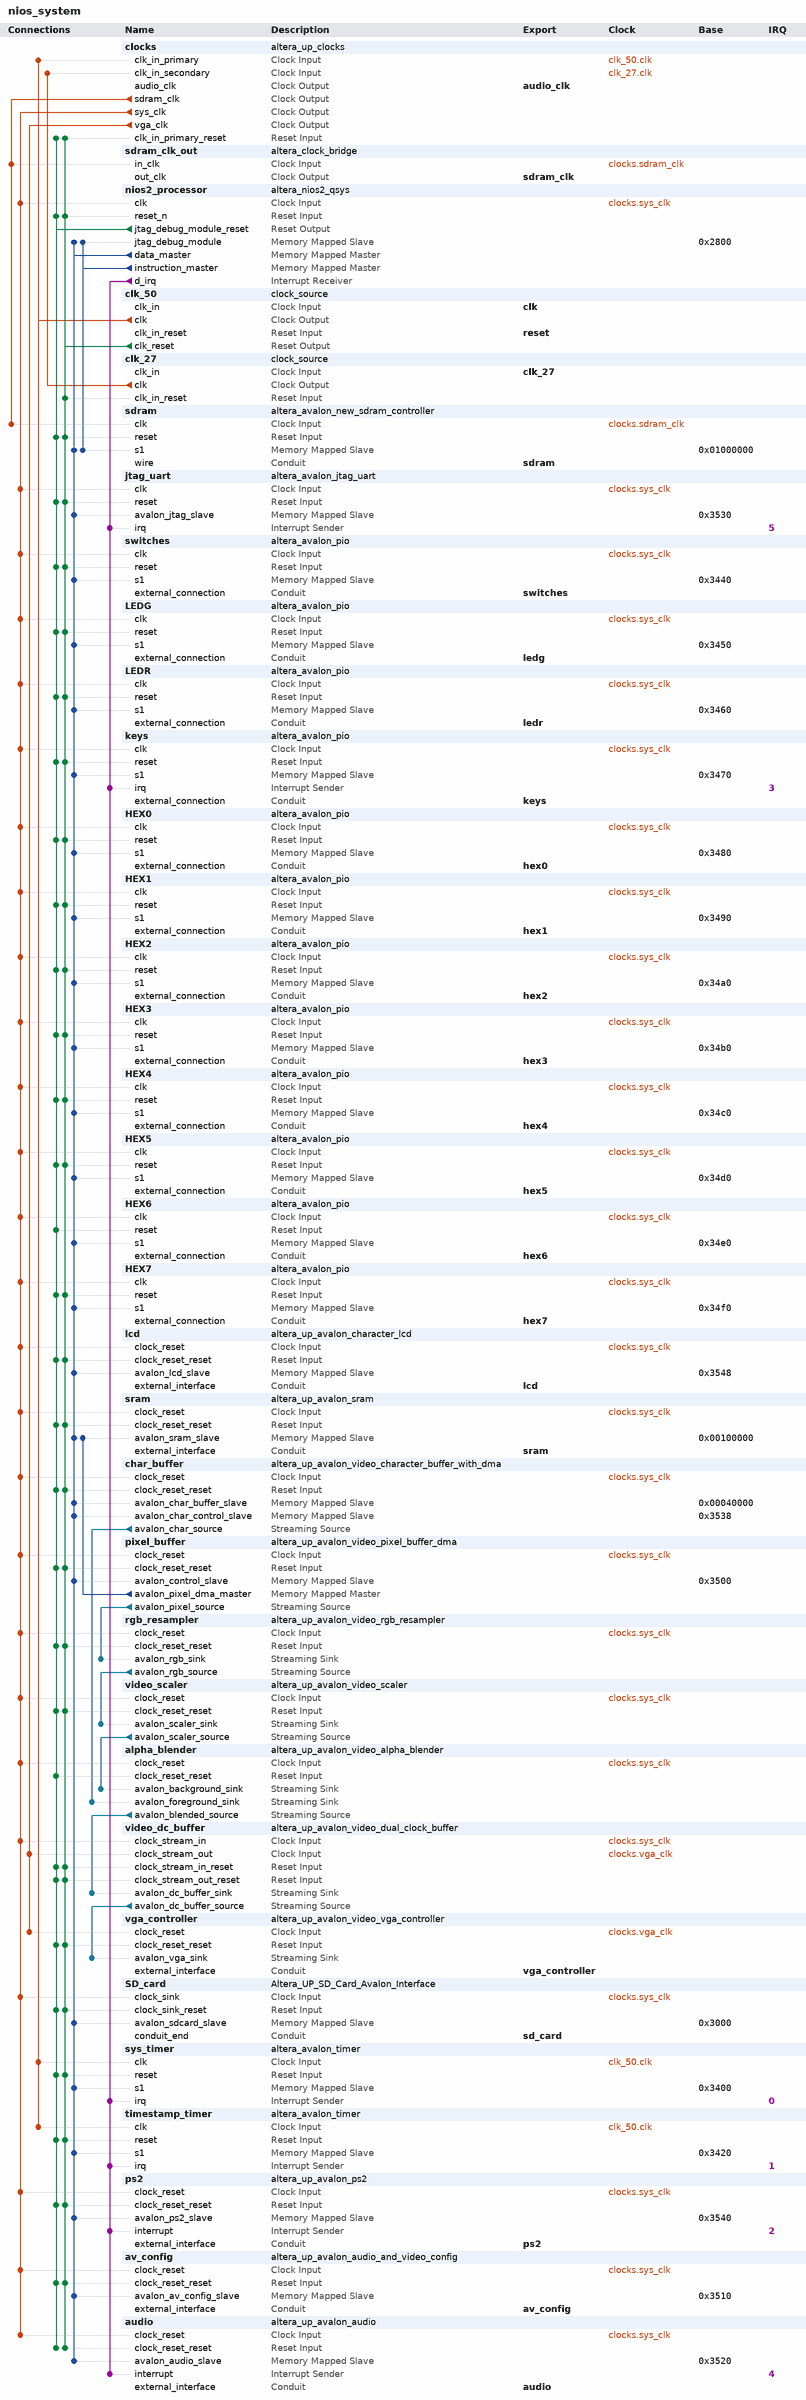
[diagram p0: system contents]
# Platform Designer (Qsys) system nios_system, Cyclone II EP2C35F672C6
# Parameters at their usual value, and those the tool derives, are not listed.
package require -exact qsys 12.0
create_system nios_system
set_project_property DEVICE_FAMILY {Cyclone II}
set_project_property DEVICE EP2C35F672C6

add_instance clocks altera_up_clocks 12.0
set_instance_parameter_value clocks board DE2
set_instance_parameter_value clocks vga_clk true
set_instance_parameter_value clocks audio_clk true
set_instance_parameter_value clocks audio_clk_freq 12.288

add_instance sdram_clk_out altera_clock_bridge 12.0
set_instance_parameter_value sdram_clk_out DERIVED_CLOCK_RATE 50000000
set_instance_parameter_value sdram_clk_out EXPLICIT_CLOCK_RATE 0

add_instance nios2_processor altera_nios2_qsys 12.0
set_instance_parameter_value nios2_processor muldiv_divider true
set_instance_parameter_value nios2_processor resetSlave sdram.s1
set_instance_parameter_value nios2_processor exceptionSlave sdram.s1
set_instance_parameter_value nios2_processor breakSlave nios2_processor.jtag_debug_module
set_instance_parameter_value nios2_processor impl Fast
set_instance_parameter_value nios2_processor icache_size 4096

add_instance clk_50 clock_source 12.0
set_instance_parameter_value clk_50 clockFrequency 50000000

add_instance clk_27 clock_source 12.0
set_instance_parameter_value clk_27 clockFrequency 27000000

add_instance sdram altera_avalon_new_sdram_controller 12.0
set_instance_parameter_value sdram TAC 5.5
set_instance_parameter_value sdram TRCD 20.0
set_instance_parameter_value sdram TRP 20.0
set_instance_parameter_value sdram casLatency 3
set_instance_parameter_value sdram columnWidth 8
set_instance_parameter_value sdram dataWidth 16
set_instance_parameter_value sdram generateSimulationModel false
set_instance_parameter_value sdram model custom
set_instance_parameter_value sdram numberOfBanks 4
set_instance_parameter_value sdram numberOfChipSelects 1
set_instance_parameter_value sdram powerUpDelay 100.0
set_instance_parameter_value sdram refreshPeriod 15.625
set_instance_parameter_value sdram rowWidth 12

add_instance jtag_uart altera_avalon_jtag_uart 12.0
set_instance_parameter_value jtag_uart simInteractiveOptions INTERACTIVE_ASCII_OUTPUT

add_instance switches altera_avalon_pio 12.0
set_instance_parameter_value switches direction Input
set_instance_parameter_value switches width 18

add_instance LEDG altera_avalon_pio 12.0
set_instance_parameter_value LEDG direction Output
set_instance_parameter_value LEDG width 8

add_instance LEDR altera_avalon_pio 12.0
set_instance_parameter_value LEDR direction Output
set_instance_parameter_value LEDR width 18

add_instance keys altera_avalon_pio 12.0
set_instance_parameter_value keys captureEdge true
set_instance_parameter_value keys direction Input
set_instance_parameter_value keys generateIRQ true
set_instance_parameter_value keys irqType EDGE
set_instance_parameter_value keys width 3

add_instance HEX0 altera_avalon_pio 12.0
set_instance_parameter_value HEX0 direction Output
set_instance_parameter_value HEX0 resetValue 127
set_instance_parameter_value HEX0 width 7

add_instance HEX1 altera_avalon_pio 12.0
set_instance_parameter_value HEX1 direction Output
set_instance_parameter_value HEX1 resetValue 127
set_instance_parameter_value HEX1 width 7

add_instance HEX2 altera_avalon_pio 12.0
set_instance_parameter_value HEX2 direction Output
set_instance_parameter_value HEX2 resetValue 127
set_instance_parameter_value HEX2 width 7

add_instance HEX3 altera_avalon_pio 12.0
set_instance_parameter_value HEX3 direction Output
set_instance_parameter_value HEX3 resetValue 127
set_instance_parameter_value HEX3 width 7

add_instance HEX4 altera_avalon_pio 12.0
set_instance_parameter_value HEX4 direction Output
set_instance_parameter_value HEX4 resetValue 127
set_instance_parameter_value HEX4 width 7

add_instance HEX5 altera_avalon_pio 12.0
set_instance_parameter_value HEX5 direction Output
set_instance_parameter_value HEX5 resetValue 127
set_instance_parameter_value HEX5 width 7

add_instance HEX6 altera_avalon_pio 12.0
set_instance_parameter_value HEX6 direction Output
set_instance_parameter_value HEX6 resetValue 127
set_instance_parameter_value HEX6 width 7

add_instance HEX7 altera_avalon_pio 12.0
set_instance_parameter_value HEX7 direction Output
set_instance_parameter_value HEX7 resetValue 127
set_instance_parameter_value HEX7 width 7

add_instance lcd altera_up_avalon_character_lcd 12.0
set_instance_parameter_value lcd cursor Normal

add_instance sram altera_up_avalon_sram 12.0
set_instance_parameter_value sram board DE2
set_instance_parameter_value sram pixel_buffer true

add_instance char_buffer altera_up_avalon_video_character_buffer_with_dma 12.0
set_instance_parameter_value char_buffer enable_transparency true

add_instance pixel_buffer altera_up_avalon_video_pixel_buffer_dma 12.0
set_instance_parameter_value pixel_buffer addr_mode Consecutive
set_instance_parameter_value pixel_buffer start_address 0
set_instance_parameter_value pixel_buffer back_start_address 153600
set_instance_parameter_value pixel_buffer image_width 320
set_instance_parameter_value pixel_buffer image_height 240
set_instance_parameter_value pixel_buffer color_space {16-bit RGB}

add_instance rgb_resampler altera_up_avalon_video_rgb_resampler 12.0
set_instance_parameter_value rgb_resampler input_type {16-bit RGB}
set_instance_parameter_value rgb_resampler output_type {30-bit RGB}
set_instance_parameter_value rgb_resampler alpha 1023

add_instance video_scaler altera_up_avalon_video_scaler 12.0
set_instance_parameter_value video_scaler width_scaling 2
set_instance_parameter_value video_scaler height_scaling 2
set_instance_parameter_value video_scaler width_in 320
set_instance_parameter_value video_scaler color_bits 10
set_instance_parameter_value video_scaler color_planes 3

add_instance alpha_blender altera_up_avalon_video_alpha_blender 12.0
set_instance_parameter_value alpha_blender mode Normal

add_instance video_dc_buffer altera_up_avalon_video_dual_clock_buffer 12.0
set_instance_parameter_value video_dc_buffer color_bits 10

add_instance vga_controller altera_up_avalon_video_vga_controller 12.0
set_instance_parameter_value vga_controller board DE2

add_instance SD_card Altera_UP_SD_Card_Avalon_Interface 1.0

add_instance sys_timer altera_avalon_timer 12.0
set_instance_parameter_value sys_timer period 1
set_instance_parameter_value sys_timer periodUnits MSEC
set_instance_parameter_value sys_timer timerPreset FULL_FEATURED

add_instance timestamp_timer altera_avalon_timer 12.0
set_instance_parameter_value timestamp_timer period 1
set_instance_parameter_value timestamp_timer periodUnits MSEC
set_instance_parameter_value timestamp_timer timerPreset FULL_FEATURED

add_instance ps2 altera_up_avalon_ps2 12.0

add_instance av_config altera_up_avalon_audio_and_video_config 12.0
set_instance_parameter_value av_config board DE2
set_instance_parameter_value av_config audio_in {Microphone to ADC}
set_instance_parameter_value av_config line_in_bypass false
set_instance_parameter_value av_config bit_length 16
set_instance_parameter_value av_config sampling_rate {32 kHz}

add_instance audio altera_up_avalon_audio 12.0
set_instance_parameter_value audio avalon_bus_type {Memory Mapped}
set_instance_parameter_value audio audio_in true
set_instance_parameter_value audio dw 16

# connections
add_connection clk_27.clk clocks.clk_in_secondary clock
add_connection clk_50.clk clocks.clk_in_primary clock
add_connection clk_50.clk sys_timer.clk clock
add_connection clk_50.clk timestamp_timer.clk clock
add_connection clocks.sdram_clk sdram.clk clock
add_connection clocks.sdram_clk sdram_clk_out.in_clk clock
add_connection clocks.sys_clk alpha_blender.clock_reset clock
add_connection clocks.sys_clk audio.clock_reset clock
add_connection clocks.sys_clk av_config.clock_reset clock
add_connection clocks.sys_clk char_buffer.clock_reset clock
add_connection clocks.sys_clk HEX0.clk clock
add_connection clocks.sys_clk HEX1.clk clock
add_connection clocks.sys_clk HEX2.clk clock
add_connection clocks.sys_clk HEX3.clk clock
add_connection clocks.sys_clk HEX4.clk clock
add_connection clocks.sys_clk HEX5.clk clock
add_connection clocks.sys_clk HEX6.clk clock
add_connection clocks.sys_clk HEX7.clk clock
add_connection clocks.sys_clk jtag_uart.clk clock
add_connection clocks.sys_clk keys.clk clock
add_connection clocks.sys_clk lcd.clock_reset clock
add_connection clocks.sys_clk LEDG.clk clock
add_connection clocks.sys_clk LEDR.clk clock
add_connection clocks.sys_clk nios2_processor.clk clock
add_connection clocks.sys_clk pixel_buffer.clock_reset clock
add_connection clocks.sys_clk ps2.clock_reset clock
add_connection clocks.sys_clk rgb_resampler.clock_reset clock
add_connection clocks.sys_clk SD_card.clock_sink clock
add_connection clocks.sys_clk sram.clock_reset clock
add_connection clocks.sys_clk switches.clk clock
add_connection clocks.sys_clk video_dc_buffer.clock_stream_in clock
add_connection clocks.sys_clk video_scaler.clock_reset clock
add_connection clocks.vga_clk vga_controller.clock_reset clock
add_connection clocks.vga_clk video_dc_buffer.clock_stream_out clock
add_connection clk_50.clk_reset audio.clock_reset_reset reset
add_connection clk_50.clk_reset av_config.clock_reset_reset reset
add_connection clk_50.clk_reset char_buffer.clock_reset_reset reset
add_connection clk_50.clk_reset clk_27.clk_in_reset reset
add_connection clk_50.clk_reset clocks.clk_in_primary_reset reset
add_connection clk_50.clk_reset HEX0.reset reset
add_connection clk_50.clk_reset HEX1.reset reset
add_connection clk_50.clk_reset HEX2.reset reset
add_connection clk_50.clk_reset HEX3.reset reset
add_connection clk_50.clk_reset HEX4.reset reset
add_connection clk_50.clk_reset HEX5.reset reset
add_connection clk_50.clk_reset HEX7.reset reset
add_connection clk_50.clk_reset jtag_uart.reset reset
add_connection clk_50.clk_reset keys.reset reset
add_connection clk_50.clk_reset lcd.clock_reset_reset reset
add_connection clk_50.clk_reset LEDG.reset reset
add_connection clk_50.clk_reset LEDR.reset reset
add_connection clk_50.clk_reset nios2_processor.reset_n reset
add_connection clk_50.clk_reset pixel_buffer.clock_reset_reset reset
add_connection clk_50.clk_reset ps2.clock_reset_reset reset
add_connection clk_50.clk_reset rgb_resampler.clock_reset_reset reset
add_connection clk_50.clk_reset SD_card.clock_sink_reset reset
add_connection clk_50.clk_reset sdram.reset reset
add_connection clk_50.clk_reset sram.clock_reset_reset reset
add_connection clk_50.clk_reset switches.reset reset
add_connection clk_50.clk_reset sys_timer.reset reset
add_connection clk_50.clk_reset timestamp_timer.reset reset
add_connection clk_50.clk_reset vga_controller.clock_reset_reset reset
add_connection clk_50.clk_reset video_dc_buffer.clock_stream_in_reset reset
add_connection clk_50.clk_reset video_dc_buffer.clock_stream_out_reset reset
add_connection clk_50.clk_reset video_scaler.clock_reset_reset reset
add_connection nios2_processor.jtag_debug_module_reset alpha_blender.clock_reset_reset reset
add_connection nios2_processor.jtag_debug_module_reset audio.clock_reset_reset reset
add_connection nios2_processor.jtag_debug_module_reset av_config.clock_reset_reset reset
add_connection nios2_processor.jtag_debug_module_reset char_buffer.clock_reset_reset reset
add_connection nios2_processor.jtag_debug_module_reset clocks.clk_in_primary_reset reset
add_connection nios2_processor.jtag_debug_module_reset HEX0.reset reset
add_connection nios2_processor.jtag_debug_module_reset HEX1.reset reset
add_connection nios2_processor.jtag_debug_module_reset HEX2.reset reset
add_connection nios2_processor.jtag_debug_module_reset HEX3.reset reset
add_connection nios2_processor.jtag_debug_module_reset HEX4.reset reset
add_connection nios2_processor.jtag_debug_module_reset HEX5.reset reset
add_connection nios2_processor.jtag_debug_module_reset HEX6.reset reset
add_connection nios2_processor.jtag_debug_module_reset HEX7.reset reset
add_connection nios2_processor.jtag_debug_module_reset jtag_uart.reset reset
add_connection nios2_processor.jtag_debug_module_reset keys.reset reset
add_connection nios2_processor.jtag_debug_module_reset lcd.clock_reset_reset reset
add_connection nios2_processor.jtag_debug_module_reset LEDG.reset reset
add_connection nios2_processor.jtag_debug_module_reset LEDR.reset reset
add_connection nios2_processor.jtag_debug_module_reset nios2_processor.reset_n reset
add_connection nios2_processor.jtag_debug_module_reset pixel_buffer.clock_reset_reset reset
add_connection nios2_processor.jtag_debug_module_reset ps2.clock_reset_reset reset
add_connection nios2_processor.jtag_debug_module_reset rgb_resampler.clock_reset_reset reset
add_connection nios2_processor.jtag_debug_module_reset SD_card.clock_sink_reset reset
add_connection nios2_processor.jtag_debug_module_reset sdram.reset reset
add_connection nios2_processor.jtag_debug_module_reset sram.clock_reset_reset reset
add_connection nios2_processor.jtag_debug_module_reset switches.reset reset
add_connection nios2_processor.jtag_debug_module_reset sys_timer.reset reset
add_connection nios2_processor.jtag_debug_module_reset timestamp_timer.reset reset
add_connection nios2_processor.jtag_debug_module_reset vga_controller.clock_reset_reset reset
add_connection nios2_processor.jtag_debug_module_reset video_dc_buffer.clock_stream_in_reset reset
add_connection nios2_processor.jtag_debug_module_reset video_dc_buffer.clock_stream_out_reset reset
add_connection nios2_processor.jtag_debug_module_reset video_scaler.clock_reset_reset reset
add_connection nios2_processor.data_master audio.avalon_audio_slave avalon
set_connection_parameter_value nios2_processor.data_master/audio.avalon_audio_slave baseAddress 0x3520
add_connection nios2_processor.data_master av_config.avalon_av_config_slave avalon
set_connection_parameter_value nios2_processor.data_master/av_config.avalon_av_config_slave baseAddress 0x3510
add_connection nios2_processor.data_master char_buffer.avalon_char_buffer_slave avalon
set_connection_parameter_value nios2_processor.data_master/char_buffer.avalon_char_buffer_slave baseAddress 0x00040000
add_connection nios2_processor.data_master char_buffer.avalon_char_control_slave avalon
set_connection_parameter_value nios2_processor.data_master/char_buffer.avalon_char_control_slave baseAddress 0x3538
add_connection nios2_processor.data_master HEX0.s1 avalon
set_connection_parameter_value nios2_processor.data_master/HEX0.s1 baseAddress 0x3480
add_connection nios2_processor.data_master HEX1.s1 avalon
set_connection_parameter_value nios2_processor.data_master/HEX1.s1 baseAddress 0x3490
add_connection nios2_processor.data_master HEX2.s1 avalon
set_connection_parameter_value nios2_processor.data_master/HEX2.s1 baseAddress 0x34a0
add_connection nios2_processor.data_master HEX3.s1 avalon
set_connection_parameter_value nios2_processor.data_master/HEX3.s1 baseAddress 0x34b0
add_connection nios2_processor.data_master HEX4.s1 avalon
set_connection_parameter_value nios2_processor.data_master/HEX4.s1 baseAddress 0x34c0
add_connection nios2_processor.data_master HEX5.s1 avalon
set_connection_parameter_value nios2_processor.data_master/HEX5.s1 baseAddress 0x34d0
add_connection nios2_processor.data_master HEX6.s1 avalon
set_connection_parameter_value nios2_processor.data_master/HEX6.s1 baseAddress 0x34e0
add_connection nios2_processor.data_master HEX7.s1 avalon
set_connection_parameter_value nios2_processor.data_master/HEX7.s1 baseAddress 0x34f0
add_connection nios2_processor.data_master jtag_uart.avalon_jtag_slave avalon
set_connection_parameter_value nios2_processor.data_master/jtag_uart.avalon_jtag_slave baseAddress 0x3530
add_connection nios2_processor.data_master keys.s1 avalon
set_connection_parameter_value nios2_processor.data_master/keys.s1 baseAddress 0x3470
add_connection nios2_processor.data_master lcd.avalon_lcd_slave avalon
set_connection_parameter_value nios2_processor.data_master/lcd.avalon_lcd_slave baseAddress 0x3548
add_connection nios2_processor.data_master LEDG.s1 avalon
set_connection_parameter_value nios2_processor.data_master/LEDG.s1 baseAddress 0x3450
add_connection nios2_processor.data_master LEDR.s1 avalon
set_connection_parameter_value nios2_processor.data_master/LEDR.s1 baseAddress 0x3460
add_connection nios2_processor.data_master nios2_processor.jtag_debug_module avalon
set_connection_parameter_value nios2_processor.data_master/nios2_processor.jtag_debug_module baseAddress 0x2800
add_connection nios2_processor.data_master pixel_buffer.avalon_control_slave avalon
set_connection_parameter_value nios2_processor.data_master/pixel_buffer.avalon_control_slave baseAddress 0x3500
add_connection nios2_processor.data_master ps2.avalon_ps2_slave avalon
set_connection_parameter_value nios2_processor.data_master/ps2.avalon_ps2_slave baseAddress 0x3540
add_connection nios2_processor.data_master SD_card.avalon_sdcard_slave avalon
set_connection_parameter_value nios2_processor.data_master/SD_card.avalon_sdcard_slave baseAddress 0x3000
add_connection nios2_processor.data_master sdram.s1 avalon
set_connection_parameter_value nios2_processor.data_master/sdram.s1 baseAddress 0x01000000
add_connection nios2_processor.data_master sram.avalon_sram_slave avalon
set_connection_parameter_value nios2_processor.data_master/sram.avalon_sram_slave baseAddress 0x00100000
add_connection nios2_processor.data_master switches.s1 avalon
set_connection_parameter_value nios2_processor.data_master/switches.s1 baseAddress 0x3440
add_connection nios2_processor.data_master sys_timer.s1 avalon
set_connection_parameter_value nios2_processor.data_master/sys_timer.s1 baseAddress 0x3400
add_connection nios2_processor.data_master timestamp_timer.s1 avalon
set_connection_parameter_value nios2_processor.data_master/timestamp_timer.s1 baseAddress 0x3420
add_connection nios2_processor.instruction_master nios2_processor.jtag_debug_module avalon
set_connection_parameter_value nios2_processor.instruction_master/nios2_processor.jtag_debug_module baseAddress 0x2800
add_connection nios2_processor.instruction_master sdram.s1 avalon
set_connection_parameter_value nios2_processor.instruction_master/sdram.s1 baseAddress 0x01000000
add_connection pixel_buffer.avalon_pixel_dma_master sram.avalon_sram_slave avalon
set_connection_parameter_value pixel_buffer.avalon_pixel_dma_master/sram.avalon_sram_slave baseAddress 0x00100000
add_connection alpha_blender.avalon_blended_source video_dc_buffer.avalon_dc_buffer_sink avalon_streaming
add_connection char_buffer.avalon_char_source alpha_blender.avalon_foreground_sink avalon_streaming
add_connection pixel_buffer.avalon_pixel_source rgb_resampler.avalon_rgb_sink avalon_streaming
add_connection rgb_resampler.avalon_rgb_source video_scaler.avalon_scaler_sink avalon_streaming
add_connection video_dc_buffer.avalon_dc_buffer_source vga_controller.avalon_vga_sink avalon_streaming
add_connection video_scaler.avalon_scaler_source alpha_blender.avalon_background_sink avalon_streaming
add_connection nios2_processor.d_irq audio.interrupt interrupt
set_connection_parameter_value nios2_processor.d_irq/audio.interrupt irqNumber 4
add_connection nios2_processor.d_irq jtag_uart.irq interrupt
set_connection_parameter_value nios2_processor.d_irq/jtag_uart.irq irqNumber 5
add_connection nios2_processor.d_irq keys.irq interrupt
set_connection_parameter_value nios2_processor.d_irq/keys.irq irqNumber 3
add_connection nios2_processor.d_irq ps2.interrupt interrupt
set_connection_parameter_value nios2_processor.d_irq/ps2.interrupt irqNumber 2
add_connection nios2_processor.d_irq sys_timer.irq interrupt
set_connection_parameter_value nios2_processor.d_irq/sys_timer.irq irqNumber 0
add_connection nios2_processor.d_irq timestamp_timer.irq interrupt
set_connection_parameter_value nios2_processor.d_irq/timestamp_timer.irq irqNumber 1

# exported interfaces
add_interface clk clock sink
set_interface_property clk EXPORT_OF clk_50.clk_in
add_interface reset reset sink
set_interface_property reset EXPORT_OF clk_50.clk_in_reset
add_interface sdram conduit end
set_interface_property sdram EXPORT_OF sdram.wire
add_interface sdram_clk clock source
set_interface_property sdram_clk EXPORT_OF sdram_clk_out.out_clk
add_interface sram conduit end
set_interface_property sram EXPORT_OF sram.external_interface
add_interface switches conduit end
set_interface_property switches EXPORT_OF switches.external_connection
add_interface ledg conduit end
set_interface_property ledg EXPORT_OF LEDG.external_connection
add_interface ledr conduit end
set_interface_property ledr EXPORT_OF LEDR.external_connection
add_interface keys conduit end
set_interface_property keys EXPORT_OF keys.external_connection
add_interface hex0 conduit end
set_interface_property hex0 EXPORT_OF HEX0.external_connection
add_interface hex1 conduit end
set_interface_property hex1 EXPORT_OF HEX1.external_connection
add_interface hex2 conduit end
set_interface_property hex2 EXPORT_OF HEX2.external_connection
add_interface hex3 conduit end
set_interface_property hex3 EXPORT_OF HEX3.external_connection
add_interface hex4 conduit end
set_interface_property hex4 EXPORT_OF HEX4.external_connection
add_interface hex5 conduit end
set_interface_property hex5 EXPORT_OF HEX5.external_connection
add_interface hex6 conduit end
set_interface_property hex6 EXPORT_OF HEX6.external_connection
add_interface hex7 conduit end
set_interface_property hex7 EXPORT_OF HEX7.external_connection
add_interface lcd conduit end
set_interface_property lcd EXPORT_OF lcd.external_interface
add_interface vga_controller conduit end
set_interface_property vga_controller EXPORT_OF vga_controller.external_interface
add_interface sd_card conduit end
set_interface_property sd_card EXPORT_OF SD_card.conduit_end
add_interface clk_27 clock sink
set_interface_property clk_27 EXPORT_OF clk_27.clk_in
add_interface audio_clk clock source
set_interface_property audio_clk EXPORT_OF clocks.audio_clk
add_interface ps2 conduit end
set_interface_property ps2 EXPORT_OF ps2.external_interface
add_interface av_config conduit end
set_interface_property av_config EXPORT_OF av_config.external_interface
add_interface audio conduit end
set_interface_property audio EXPORT_OF audio.external_interface

save_system nios_system.qsys
